# Altium schematic sheet 485_CommunicactionInterface.SchDoc
size A4
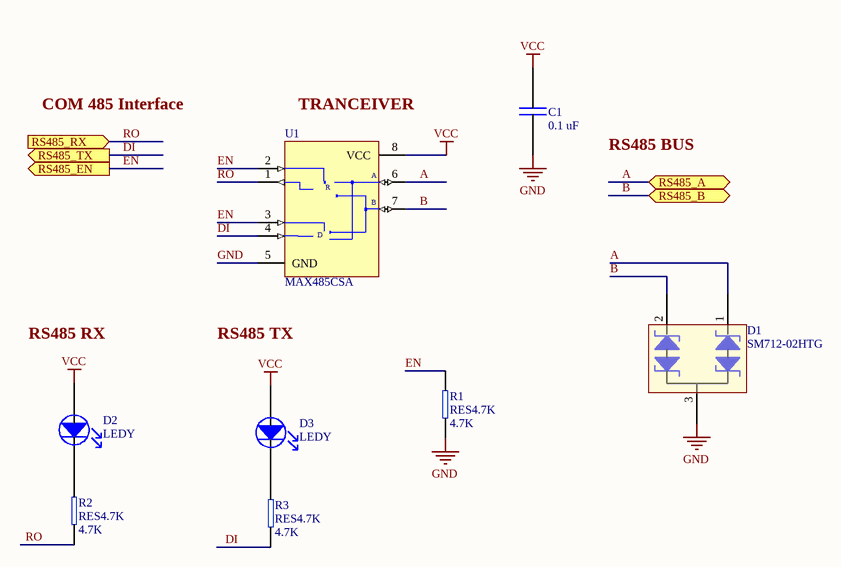
[diagram p0: 485_CommunicactionInterface.SchDoc]

## Parts
C1  value 0.1 uF  [CAP0603]  (hidden comment: CAP0.1uF)
D1  SM712-02HTG  [SW712]
D2  LEDY  [150060YS75000]
D3  LEDY  [150060YS75000]
R1  RES4.7K  value 4.7K  [RES0603]
R2  RES4.7K  value 4.7K  [RES0603]
R3  RES4.7K  value 4.7K  [RES0603]
U1  MAX485CSA  [NSO8_N]

## Ports
RS485_A (bidir), RS485_B (bidir), RS485_EN (out), RS485_RX (in), RS485_TX (out)

## Nets
GND: C1.2 D1.3 R1.2(neg) U1.5(GND)
VCC: C1.1 D2.2(Anode) D3.2(Anode) U1.8(VCC)
A: D1.1 U1.6(A) ; port RS485_A
B: D1.2 U1.7(B) ; port RS485_B
DI: R3.2(neg) U1.4(DI) ; port RS485_TX
EN: R1.1(pos) U1.2(~{RE}) U1.3(DE) ; port RS485_EN
RO: R2.2(neg) U1.1(RO) ; port RS485_RX
NetD2_1: D2.1(Cathode) R2.1(pos)
NetD3_1: D3.1(Cathode) R3.1(pos)

## Notes on the sheet
- Labels drawn without touching a wire or pin: COM 485 Interface, RS485 BUS, RS485 RX, RS485 TX, TRANCEIVER
- (in symbol MAX485CSA) R; D

## Library data of the parts
C1 = C0.1UF: Capacitores cerámicos de capas múltiples (MLCC) - SMD/SMT 0603 0.1uF 16volts X7R 5%; MPN: VJ0603Y104JXJPW1BC; Supplier PN: 77-VJ0603Y104JXJPBC; Supplier: Mouser
D1 = SM712-02HTG: Secuencias de diodos de TVS 600W 2 Channel Green Asymmetrical SOT23-3 (- 7 V to + 12 V); Supplier: Mouser; Supplier PN: 576-SM712-02HTG; MPN: SM712-02HTG; Value: TVS 600W
D2 D3 = LEDY: LED estándar - SMD (montaje superficial) WL-SMCW SMDMono TpVw Waterclr 0603 Yellow; Supplier: Mouser; Supplier PN: 710-150060YS75000; MPN: 150060YS75000; Value: Yellow
R1-R3 = RES4.7K: Resistores de película gruesa - SMD 1/10watt 4.7Kohms 1%; MPN: CRCW06034K70FKEA; Supplier PN: 71-CRCW0603-4.7K-E3; Supplier: Mouser
U1 = MAX485CSA: Low-Power, Slew-Rate-Limited RS-485/RS-422 Transceiver; MPN: MAX485CSA+; Value: RS485; Supplier: Mouser; Supplier PN: 700-MAX485CSA